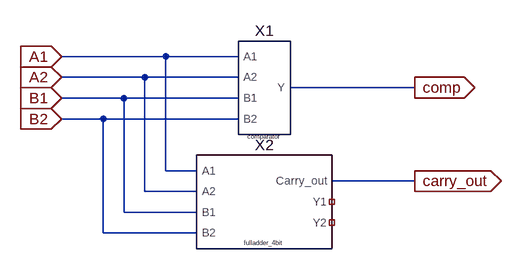
[diagram p0: schematic Comp_adder.asc]
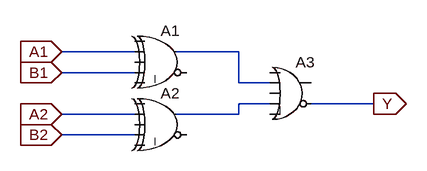
[diagram p1: sub-circuit comparator.asc]
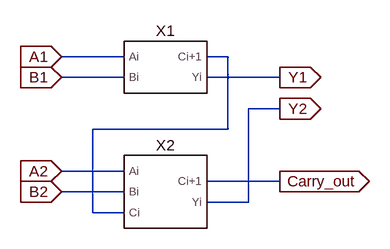
[diagram p2: sub-circuit fulladder_4bit.asc]
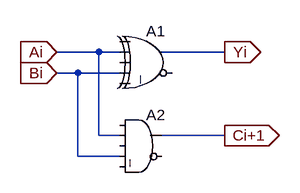
[diagram p3: sub-circuit halfadder.asc]
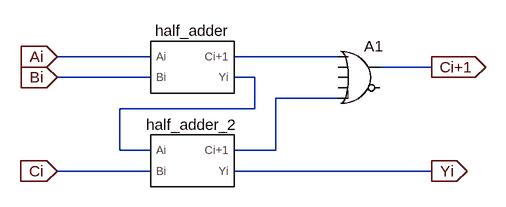
[diagram p4: sub-circuit fulladder.asc]
Comp_adder.asc, the LTspice schematic file:
Version 4
SHEET 1 880 680
WIRE 32 64 -128 64
WIRE 144 64 32 64
WIRE 0 96 -128 96
WIRE 144 96 0 96
WIRE 416 112 224 112
WIRE -32 128 -128 128
WIRE 144 128 -32 128
WIRE -64 160 -128 160
WIRE 144 160 -64 160
WIRE 32 240 32 64
WIRE 80 240 32 240
WIRE 416 256 288 256
WIRE 0 272 0 96
WIRE 80 272 0 272
WIRE -32 304 -32 128
WIRE 80 304 -32 304
WIRE -64 336 -64 160
WIRE 80 336 -64 336
FLAG -128 64 A1
IOPIN -128 64 In
FLAG -128 96 A2
IOPIN -128 96 In
FLAG -128 128 B1
IOPIN -128 128 In
FLAG -128 160 B2
IOPIN -128 160 In
FLAG 416 112 comp
IOPIN 416 112 Out
FLAG 416 256 carry_out
IOPIN 416 256 Out
SYMBOL comparator 176 112 R0
SYMATTR InstName X1
SYMBOL fulladder_4bit 176 288 R0
SYMATTR InstName X2

comparator.asc, the sub-circuit schematic file:
Version 4
SHEET 1 880 680
WIRE 112 96 0 96
WIRE 272 96 176 96
WIRE 112 128 0 128
WIRE 272 144 272 96
WIRE 320 144 272 144
WIRE 320 176 272 176
WIRE 480 176 384 176
WIRE 112 192 0 192
WIRE 272 192 272 176
WIRE 272 192 176 192
WIRE 112 224 0 224
FLAG 0 96 A1
IOPIN 0 96 In
FLAG 0 128 B1
IOPIN 0 128 In
FLAG 0 192 A2
IOPIN 0 192 In
FLAG 0 224 B2
IOPIN 0 224 In
FLAG 480 176 Y
IOPIN 480 176 Out
SYMBOL Digital\\xor 160 48 R0
SYMATTR InstName A1
SYMBOL Digital\\xor 160 144 R0
SYMATTR InstName A2
SYMBOL Digital\\or 352 96 R0
SYMATTR InstName A3

fulladder_4bit.asc, the sub-circuit schematic file:
Version 4
SHEET 1 880 680
WIRE 32 144 -64 144
WIRE 192 144 160 144
WIRE 32 176 -64 176
WIRE 272 176 160 176
WIRE 272 224 224 224
WIRE 192 256 192 144
WIRE 192 256 -16 256
WIRE 32 320 -64 320
WIRE 272 336 160 336
WIRE 32 352 -64 352
WIRE 224 368 224 224
WIRE 224 368 160 368
WIRE -16 384 -16 256
WIRE 32 384 -16 384
FLAG -64 144 A1
IOPIN -64 144 In
FLAG -64 176 B1
IOPIN -64 176 In
FLAG -64 320 A2
IOPIN -64 320 In
FLAG -64 352 B2
IOPIN -64 352 In
FLAG 272 176 Y1
IOPIN 272 176 Out
FLAG 272 224 Y2
IOPIN 272 224 Out
FLAG 272 336 Carry_out
IOPIN 272 336 Out
SYMBOL halfadder 96 160 R0
SYMATTR InstName X1
SYMBOL fulladder 96 352 R0
SYMATTR InstName X2

halfadder.asc, the sub-circuit schematic file:
Version 4
SHEET 1 880 680
WIRE 112 176 48 176
WIRE 144 176 112 176
WIRE 304 176 208 176
WIRE 80 208 48 208
WIRE 144 208 80 208
WIRE 112 304 112 176
WIRE 144 304 112 304
WIRE 304 304 208 304
WIRE 80 336 80 208
WIRE 144 336 80 336
FLAG 48 176 Ai
IOPIN 48 176 In
FLAG 48 208 Bi
IOPIN 48 208 In
FLAG 304 176 Yi
IOPIN 304 176 Out
FLAG 304 304 Ci+1
IOPIN 304 304 Out
SYMBOL Digital\\xor 192 128 R0
SYMATTR InstName A1
SYMBOL Digital\\and 176 256 R0
SYMATTR InstName A2

fulladder.asc, the sub-circuit schematic file:
Version 4
SHEET 1 880 680
WIRE 144 176 0 176
WIRE 432 176 272 176
WIRE 576 192 496 192
WIRE 144 208 0 208
WIRE 304 208 272 208
WIRE 432 240 336 240
WIRE 304 256 304 208
WIRE 304 256 96 256
WIRE 96 320 96 256
WIRE 144 320 96 320
WIRE 336 320 336 240
WIRE 336 320 272 320
WIRE 144 352 0 352
WIRE 576 352 272 352
FLAG 0 176 Ai
IOPIN 0 176 In
FLAG 0 208 Bi
IOPIN 0 208 In
FLAG 576 192 Ci+1
IOPIN 576 192 Out
FLAG 0 352 Ci
IOPIN 0 352 In
FLAG 576 352 Yi
IOPIN 576 352 Out
SYMBOL halfadder 208 192 R0
SYMATTR InstName half_adder
SYMBOL halfadder 208 336 R0
SYMATTR InstName half_adder_2
SYMBOL Digital\\or 464 144 R0
SYMATTR InstName A1

The netlist it stands for:
* Comp_adder.asc
XX1 A1 A2 B1 B2 comp comparator params: comparator
XX2 A1 A2 B1 B2 carry_out NC_01 NC_02 fulladder_4bit params: fulladder_4bit

* block symbol definitions
.subckt comparator A1 A2 B1 B2 Y
A1 0 A1 0 B1 0 0 N001 0 XOR
A2 0 A2 0 B2 0 0 N002 0 XOR
A3 0 N001 0 N002 0 Y 0 0 OR
.ends comparator

.subckt fulladder_4bit A1 A2 B1 B2 Carry_out Y1 Y2
XX1 A1 B1 N001 Y1 halfadder params: halfadder
XX2 A2 B2 N001 Carry_out Y2 fulladder params: fulladder
.ends fulladder_4bit

.subckt halfadder Ai Bi Ci+1 Yi
A1 0 Ai 0 Bi 0 0 Yi 0 XOR
A2 0 Ai 0 Bi 0 0 Ci+1 0 AND
.ends halfadder

.subckt fulladder Ai Bi Ci Ci+1 Yi
Xhalf_adder Ai Bi N001 N002 halfadder params: halfadder
Xhalf_adder_2 N002 Ci N003 Yi halfadder params: halfadder
A1 N001 0 0 0 N003 0 Ci+1 0 OR
.ends fulladder

.backanno
.end